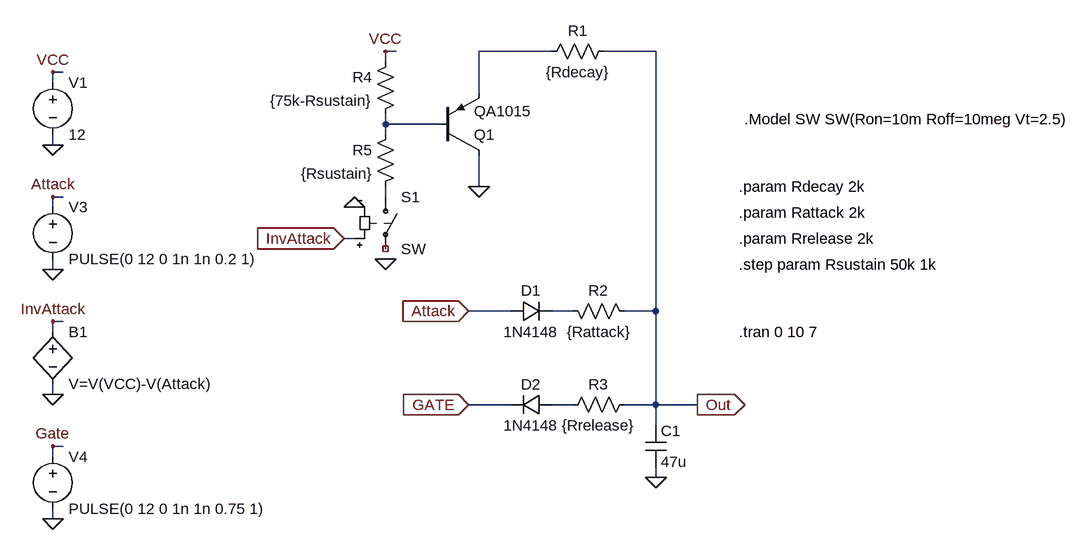
[diagram p0: schematic EG_Analog2_0_analog_sw.asc]
EG_Analog2_0_analog_sw.asc, the LTspice schematic file:
Version 4
SHEET 1 1616 724
WIRE 496 -336 480 -336
WIRE 736 -336 624 -336
WIRE 896 -336 816 -336
WIRE 480 -320 480 -336
WIRE -16 -304 -32 -304
WIRE -32 -288 -32 -304
WIRE 624 -272 624 -336
WIRE 480 -224 480 -240
WIRE 560 -224 480 -224
WIRE 480 -208 480 -224
WIRE -32 -192 -32 -208
WIRE 624 -128 624 -176
WIRE -16 -112 -32 -112
WIRE 480 -112 480 -128
WIRE -32 -96 -32 -112
WIRE 432 -48 416 -48
WIRE -32 0 -32 -16
WIRE 672 64 608 64
WIRE 768 64 736 64
WIRE 896 64 896 -336
WIRE 896 64 848 64
WIRE -16 80 -32 80
WIRE -32 96 -32 80
WIRE -32 192 -32 176
WIRE 672 208 608 208
WIRE 768 208 736 208
WIRE 896 208 896 64
WIRE 896 208 848 208
WIRE 960 208 896 208
WIRE 896 240 896 208
WIRE -16 272 -32 272
WIRE -32 288 -32 272
WIRE 896 320 896 304
WIRE -32 384 -32 368
FLAG 416 -48 InvAttack
IOPIN 416 -48 In
FLAG 608 64 Attack
IOPIN 608 64 In
FLAG 608 208 GATE
IOPIN 608 208 In
FLAG 896 320 0
FLAG 960 208 Out
IOPIN 960 208 Out
FLAG -32 -192 0
FLAG -32 192 0
FLAG -32 -304 VCC
FLAG -32 80 InvAttack
FLAG -32 -112 Attack
FLAG -32 0 0
FLAG -32 384 0
FLAG -32 272 Gate
FLAG 480 -336 VCC
FLAG 624 -128 0
FLAG 480 -16 0
FLAG 432 -96 0
SYMBOL res 832 -352 R90
WINDOW 0 0 56 VBottom 2
WINDOW 3 32 56 VTop 2
SYMATTR InstName R1
SYMATTR Value {Rdecay}
SYMBOL diode 672 80 R270
WINDOW 0 32 32 VTop 2
WINDOW 3 0 32 VBottom 2
SYMATTR InstName D1
SYMATTR Value 1N4148
SYMBOL res 752 48 M90
WINDOW 0 0 56 VBottom 2
WINDOW 3 32 56 VTop 2
SYMATTR InstName R2
SYMATTR Value {Rattack}
SYMBOL diode 736 192 R90
WINDOW 0 0 32 VBottom 2
WINDOW 3 32 32 VTop 2
SYMATTR InstName D2
SYMATTR Value 1N4148
SYMBOL res 864 192 R90
WINDOW 0 0 56 VBottom 2
WINDOW 3 32 56 VTop 2
SYMATTR InstName R3
SYMATTR Value {Rrelease}
SYMBOL cap 880 240 R0
SYMATTR InstName C1
SYMATTR Value 47u
SYMBOL voltage -32 -304 R0
WINDOW 123 0 0 Left 2
WINDOW 39 0 0 Left 2
SYMATTR InstName V1
SYMATTR Value 12
SYMBOL voltage -32 -112 R0
WINDOW 123 0 0 Left 2
WINDOW 39 0 0 Left 2
SYMATTR InstName V3
SYMATTR Value PULSE(0 12 0 1n 1n 0.2 1)
SYMBOL voltage -32 272 R0
WINDOW 123 0 0 Left 2
WINDOW 39 0 0 Left 2
SYMATTR InstName V4
SYMATTR Value PULSE(0 12 0 1n 1n 0.75 1)
SYMBOL res 496 -336 M0
SYMATTR InstName R4
SYMATTR Value {75k-Rsustain}
SYMBOL res 496 -224 M0
SYMATTR InstName R5
SYMATTR Value {Rsustain}
SYMBOL bv -32 80 R0
SYMATTR InstName B1
SYMATTR Value V=V(VCC)-V(Attack)
SYMBOL pnp 560 -176 M180
SYMATTR InstName Q1
SYMATTR Value QA1015
SYMBOL sw 480 -128 R0
SYMATTR InstName S1
TEXT 1024 -128 Left 2 !.param Rdecay 2k
TEXT 1024 -88 Left 2 !.param Rattack 2k
TEXT 1024 -48 Left 2 !.param Rrelease 2k
TEXT 1024 96 Left 2 !.tran 0 10 7
TEXT 1024 -8 Left 2 !.step param Rsustain 50k 1k
TEXT 1032 -232 Left 2 !.Model SW SW(Ron=10m Roff=10meg Vt=2.5)

The netlist it stands for:
* EG_Analog2_0_analog_sw.asc
R1 Out N001 {Rdecay}
D1 Attack N004 1N4148
R2 N004 Out {Rattack}
D2 N005 GATE 1N4148
R3 Out N005 {Rrelease}
C1 Out 0 47u
V1 VCC 0 12
V3 Attack 0 PULSE(0 12 0 1n 1n 0.2 1)
V4 GATE 0 PULSE(0 12 0 1n 1n 0.75 1)
R4 VCC N002 {75k-Rsustain}
R5 N002 N003 {Rsustain}
B1 InvAttack 0 V=V(VCC)-V(Attack)
Q1 0 N002 N001 0 QA1015
S1 N003 NC_01 InvAttack 0 SW
.model D D
.lib standard.dio
.model NPN NPN
.model PNP PNP
.lib standard.bjt
.param Rdecay 2k
.param Rattack 2k
.param Rrelease 2k
.tran 0 10 7
.step param Rsustain 50k 1k
.Model SW SW(Ron=10m Roff=10meg Vt=2.5)
.backanno
.end